# Altium project Modulin v1.0.PrjPcb
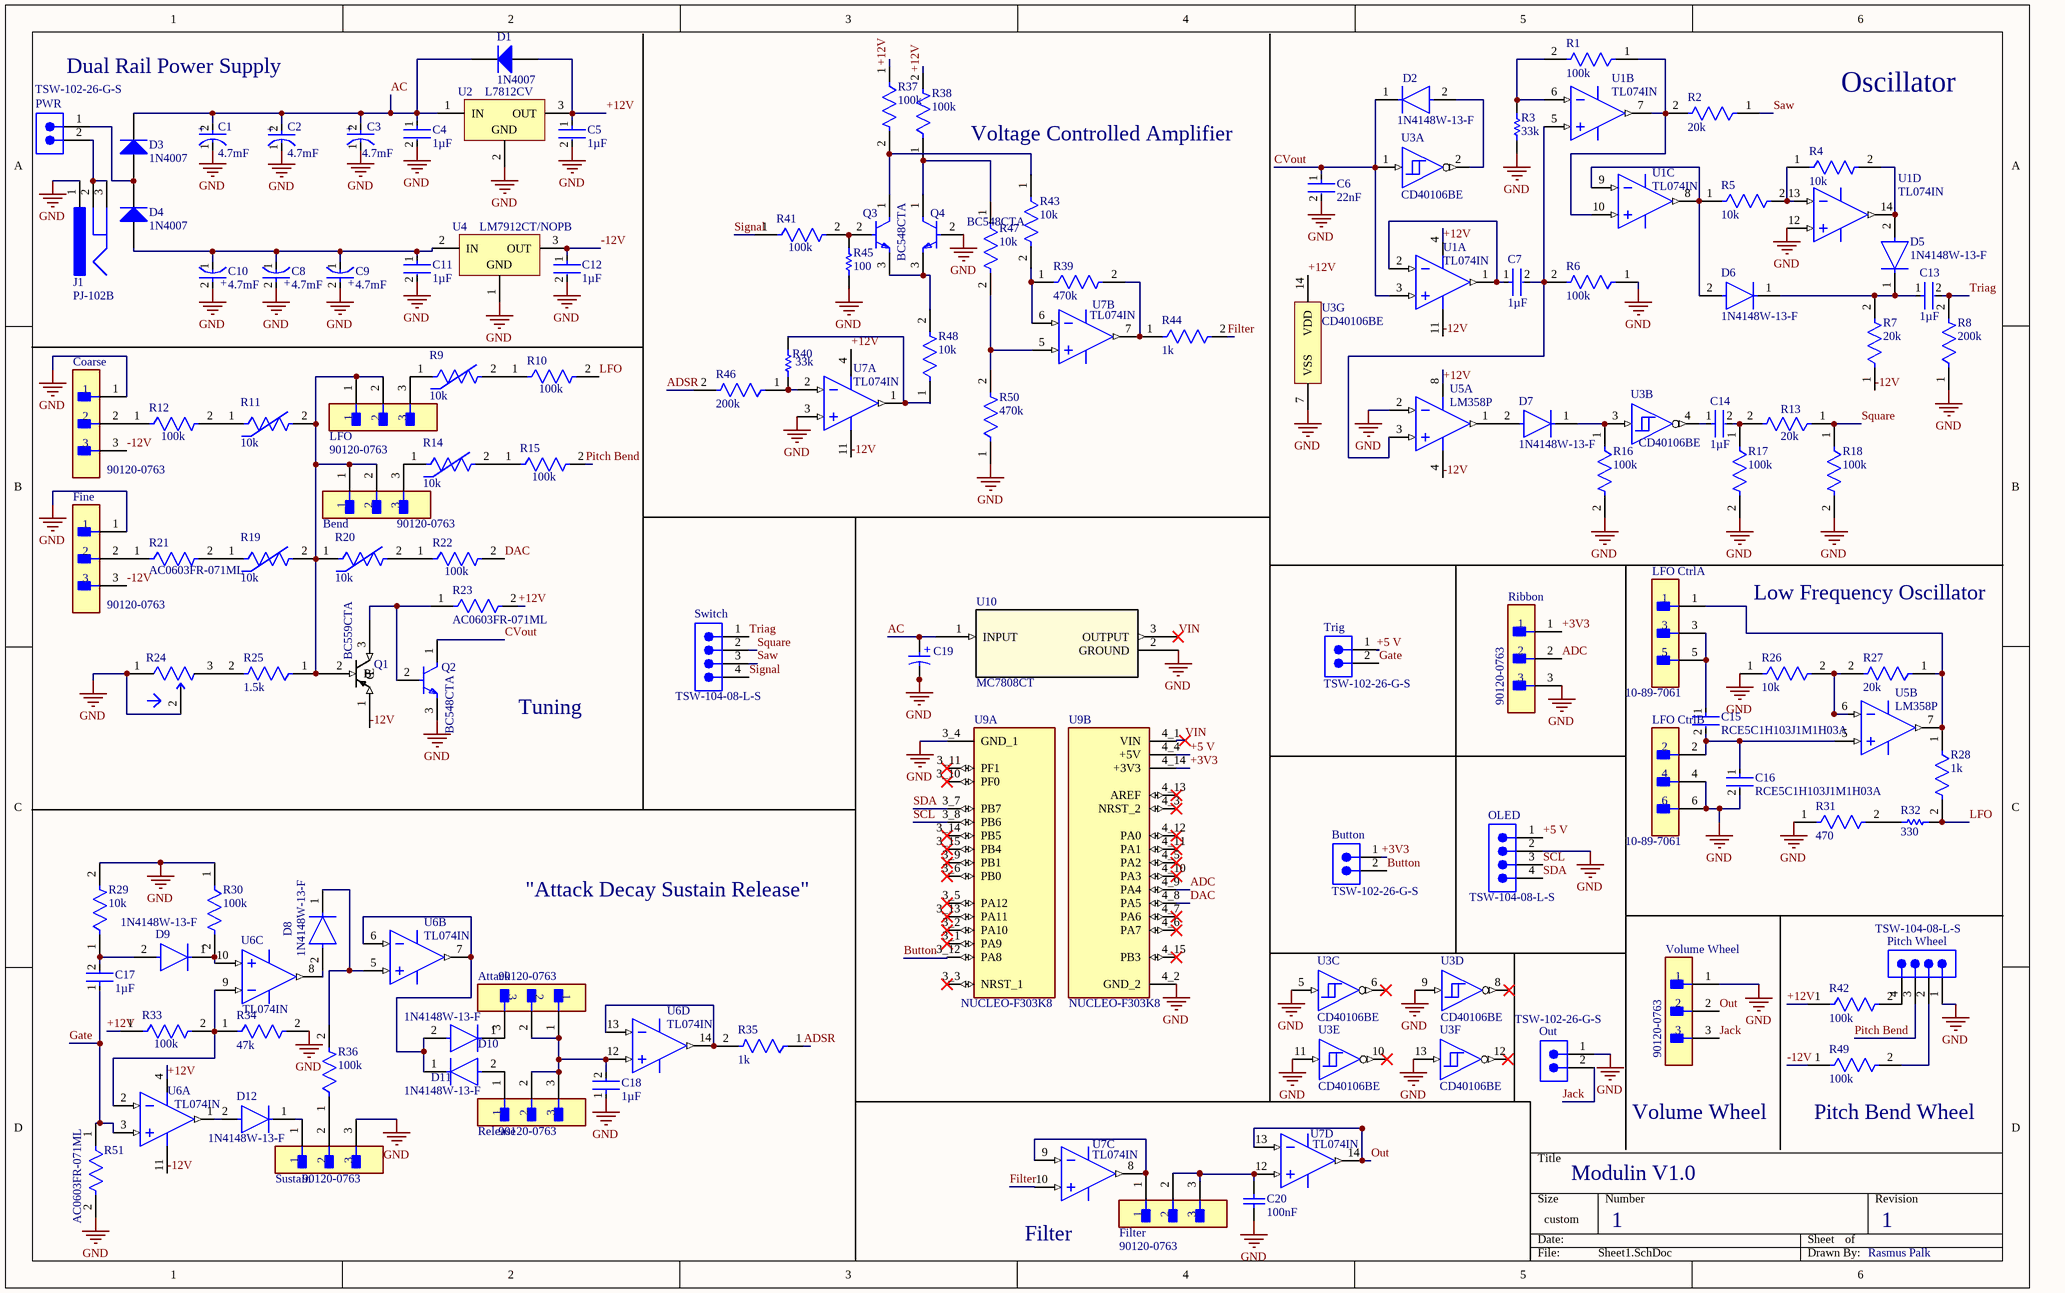
[diagram p0: Sheet1.SchDoc]
1 sheet, 115 parts. Net scope: global (net labels, ports and power ports of the same name join across sheets).
Board file: PCB1.PcbDoc

## Sheet Sheet1.SchDoc
size 381 x 241 mm; SheetNumber: 1; SheetTotal: 1

### Parts
Attack  90120-0763  [FP-90120-0763-MFG]
Bend  90120-0763  [FP-90120-0763-MFG]
Button  TSW-102-26-G-S  [SMTC-TSW-102-26-XX-S]
C1  value 4.7mF  [FP-FKK16-MFG]  (hidden comment: EEV-FK1C472M)
C2  value 4.7mF  [FP-FKK16-MFG]  (hidden comment: EEV-FK1C472M)
C3  value 4.7mF  [FP-FKK16-MFG]  (hidden comment: EEV-FK1C472M)
C4  value 1µF  [FP-0805-L_2_01_0_2-W_1_25-IPC_B]  (hidden comment: 08053C105K4Z2A)
C5  value 1µF  [FP-0805-L_2_01_0_2-W_1_25-IPC_B]  (hidden comment: 08053C105K4Z2A)
C6  value 22nF  [FP-ECQ-E6223KF9-MFG]  (hidden comment: ECQ-E6223KF9)
C7  value 1µF  [FP-0805-L_2_01_0_2-W_1_25-IPC_B]  (hidden comment: 08053C105K4Z2A)
C8  value 4.7mF  [FP-FKK16-MFG]  (hidden comment: EEV-FK1C472M)
C9  value 4.7mF  [FP-FKK16-MFG]  (hidden comment: EEV-FK1C472M)
C10  value 4.7mF  [FP-FKK16-MFG]  (hidden comment: EEV-FK1C472M)
C11  value 1µF  [FP-0805-L_2_01_0_2-W_1_25-IPC_B]  (hidden comment: 08053C105K4Z2A)
C12  value 1µF  [FP-0805-L_2_01_0_2-W_1_25-IPC_B]  (hidden comment: 08053C105K4Z2A)
C13  value 1µF  [FP-0805-L_2_01_0_2-W_1_25-IPC_B]  (hidden comment: 08053C105K4Z2A)
C14  value 1µF  [FP-0805-L_2_01_0_2-W_1_25-IPC_B]  (hidden comment: 08053C105K4Z2A)
C15  RCE5C1H103J1M1H03A  [FP-RCE1K1-2_5-MFG]
C16  RCE5C1H103J1M1H03A  [FP-RCE1K1-2_5-MFG]
C17  value 1µF  [FP-0805-L_2_01_0_2-W_1_25-IPC_B]  (hidden comment: 08053C105K4Z2A)
C18  value 1µF  [FP-0805-L_2_01_0_2-W_1_25-IPC_B]  (hidden comment: 08053C105K4Z2A)
C19  865090640003  [WCAP-ASLU_D4H5.5]  (value not drawn)
C20  value 100nF  [CAPC1608X90X35NL15T15]  (hidden comment: 0603YC104MAT4A)
Coarse  90120-0763  [FP-90120-0763-MFG]
D1  1N4007  [FAIR-DO-41-2]
D2  1N4148W-13-F  [FP-SOD123-IPC_B]
D3  1N4007  [FAIR-DO-41-2]
D4  1N4007  [FAIR-DO-41-2]
D5  1N4148W-13-F  [FP-SOD123-IPC_B]
D6  1N4148W-13-F  [FP-SOD123-IPC_B]
D7  1N4148W-13-F  [FP-SOD123-IPC_B]
D8  1N4148W-13-F  [FP-SOD123-IPC_B]
D9  1N4148W-13-F  [FP-SOD123-IPC_B]
D10  1N4148W-13-F  [FP-SOD123-IPC_B]
D11  1N4148W-13-F  [FP-SOD123-IPC_B]
D12  1N4148W-13-F  [FP-SOD123-IPC_B]
Filter  90120-0763  [FP-90120-0763-MFG]
Fine  90120-0763  [FP-90120-0763-MFG]
J1  PJ-102B  [CUI-PJ-102B_V]
LFO  90120-0763  [FP-90120-0763-MFG]
LFO_Ctrl  10-89-7061  [FP-10-89-7061-MFG]  (parts A,B of 2)
OLED  TSW-104-08-L-S  [SMTC-TSW-104-08-X-S]
Out  TSW-102-26-G-S  [SMTC-TSW-102-26-XX-S]
Pitch_Wheel  TSW-104-08-L-S  [SMTC-TSW-104-08-X-S]
PWR  TSW-102-26-G-S  [SMTC-TSW-102-26-XX-S]
Q1  BC559CTA  [TO-92-3L_5P33X5P2_ONS]
Q2  BC548CTA  [FP-135AR-MFG]
Q3  BC548CTA  [FP-135AR-MFG]
Q4  BC548CTA  [FP-135AR-MFG]
R1  value 100k  [FP-RMCF0603-MFG]  (hidden comment: RMCF0603JT100K)
R2  value 20k  [FP-CRCW0805-e3-IPC_A]  (hidden comment: CRCW080520K0FKEA)
R3  value 33k  [RESC1608X55X30NL20T20]  (hidden comment: ERA-3AEB333V)
R4  value 10k  [FP-MCT0603-MFG]  (hidden comment: MCT06030E1002BP500)
R5  value 10k  [FP-MCT0603-MFG]  (hidden comment: MCT06030E1002BP500)
R6  value 100k  [FP-RMCF0603-MFG]  (hidden comment: RMCF0603JT100K)
R7  value 20k  [FP-CRCW0805-e3-IPC_A]  (hidden comment: CRCW080520K0FKEA)
R8  value 200k  [FP-CRCW0603-e3-IPC_C]  (hidden comment: CRCW0603200KFKEA)
R9  value 10k  [FP-NTSA0_E1-MFG]  (hidden comment: NTSA0XV103EE1B0)
R10  value 100k  [FP-RMCF0603-MFG]  (hidden comment: RMCF0603JT100K)
R11  value 10k  [FP-NTSA0_E1-MFG]  (hidden comment: NTSA0XV103EE1B0)
R12  value 100k  [FP-RMCF0603-MFG]  (hidden comment: RMCF0603JT100K)
R13  value 20k  [FP-CRCW0805-e3-IPC_A]  (hidden comment: CRCW080520K0FKEA)
R14  value 10k  [FP-NTSA0_E1-MFG]  (hidden comment: NTSA0XV103EE1B0)
R15  value 100k  [FP-RMCF0603-MFG]  (hidden comment: RMCF0603JT100K)
R16  value 100k  [FP-RMCF0603-MFG]  (hidden comment: RMCF0603JT100K)
R17  value 100k  [FP-RMCF0603-MFG]  (hidden comment: RMCF0603JT100K)
R18  value 100k  [FP-RMCF0603-MFG]  (hidden comment: RMCF0603JT100K)
R19  value 10k  [FP-NTSA0_E1-MFG]  (hidden comment: NTSA0XV103EE1B0)
R20  value 10k  [FP-NTSA0_E1-MFG]  (hidden comment: NTSA0XV103EE1B0)
R21  AC0603FR-071ML  [FP-AC0603-IPC_C]
R22  value 100k  [FP-RMCF0603-MFG]  (hidden comment: RMCF0603JT100K)
R23  AC0603FR-071ML  [FP-AC0603-IPC_C]
R24  PV36W102C01B00  [FP-PV36W-MFG]  (value not drawn)
R25  value 1.5k  [FP-CRCW0603-e3-IPC_C]  (hidden comment: CRCW06031K50FKEA)
R26  value 10k  [FP-MCT0603-MFG]  (hidden comment: MCT06030E1002BP500)
R27  value 20k  [FP-CRCW0805-e3-IPC_A]  (hidden comment: CRCW080520K0FKEA)
R28  value 1k  [FP-RCA0603-e3-IPC_B]  (hidden comment: RCA06031K00FKEA)
R29  value 10k  [FP-MCT0603-MFG]  (hidden comment: MCT06030E1002BP500)
R30  value 100k  [FP-RMCF0603-MFG]  (hidden comment: RMCF0603JT100K)
R31  value 470  [FP-CPF0603-MFG]  (hidden comment: CPF0603B470RE)
R32  value 330  [RESC1608X55X30LL20T10]  (hidden comment: SG73P1JTTD3300F)
R33  value 100k  [FP-RMCF0603-MFG]  (hidden comment: RMCF0603JT100K)
R34  value 47k  [FP-MCT0603-MFG]  (hidden comment: MCT0603MD4702DP500)
R35  value 1k  [FP-RCA0603-e3-IPC_B]  (hidden comment: RCA06031K00FKEA)
R36  value 100k  [FP-RMCF0603-MFG]  (hidden comment: RMCF0603JT100K)
R37  value 100k  [FP-RMCF0603-MFG]  (hidden comment: RMCF0603JT100K)
R38  value 100k  [FP-RMCF0603-MFG]  (hidden comment: RMCF0603JT100K)
R39  value 470k  [FP-CRCW0603-e3-MFG]  (hidden comment: CRCW0603470KFKEA)
R40  value 33k  [RESC1608X55X30NL20T20]  (hidden comment: ERA-3AEB333V)
R41  value 100k  [FP-RMCF0603-MFG]  (hidden comment: RMCF0603JT100K)
R42  value 100k  [FP-RMCF0603-MFG]  (hidden comment: RMCF0603JT100K)
R43  value 10k  [FP-MCT0603-MFG]  (hidden comment: MCT06030E1002BP500)
R44  value 1k  [FP-RCA0603-e3-IPC_B]  (hidden comment: RCA06031K00FKEA)
R45  value 100  [RESC1608X50X30LL20T20]  (hidden comment: RG1608V-101-P-T1)
R46  value 200k  [FP-CRCW0603-e3-IPC_C]  (hidden comment: CRCW0603200KFKEA)
R47  value 10k  [FP-MCT0603-MFG]  (hidden comment: MCT06030E1002BP500)
R48  value 10k  [FP-MCT0603-MFG]  (hidden comment: MCT06030E1002BP500)
R49  value 100k  [FP-RMCF0603-MFG]  (hidden comment: RMCF0603JT100K)
R50  value 470k  [FP-CRCW0603-e3-MFG]  (hidden comment: CRCW0603470KFKEA)
R51  AC0603FR-071ML  [FP-AC0603-IPC_C]
Release  90120-0763  [FP-90120-0763-MFG]
Ribbon  90120-0763  [FP-90120-0763-MFG]
Sustain  90120-0763  [FP-90120-0763-MFG]
Switch  TSW-104-08-L-S  [SMTC-TSW-104-08-X-S]
Trig  TSW-102-26-G-S  [SMTC-TSW-102-26-XX-S]
U1  TL074IN  [N0014A]  (parts A,B,C,D of 4)
U2  L7812CV  [TO220]
U3  CD40106BE  [N0014A]  (parts A,B,C,D,E,F,G of 7)
U4  LM7912CT/NOPB  [NDE0003A]
U5  LM358P  [P0008A]  (parts A,B of 2)
U6  TL074IN  [N0014A]  (parts A,B,C,D of 4)
U7  TL074IN  [N0014A]  (parts A,B,C,D of 4)
U9  NUCLEO-F303K8  [MODULE_NUCLEO-F303K8]  (parts A,B of 2)
U10  MC7808CT  [TO220-3_ONS]
Volume_Wheel  90120-0763  [FP-90120-0763-MFG]

### Nets
GND: C1.1(C) C2.1(C) C3.1(C) C4.2 C5.2 C6.2 C8.2(A) C9.2(A) C10.2(A) C11.2 C12.2 C16.2 C18.1 C19.2(N) C20.1 Coarse.1 Fine.1 J1.1 LFO_Ctrl.4 LFO_Ctrl.6 OLED.2 Out.1 Pitch_Wheel.1 Q2.3(E) Q4.2(B) R3.1 R6.1 R8.1 R16.2 R17.2 R18.2 R24.1 R24.2(Wiper) R26.1 R29.2 R30.1 R31.1 R34.2 R45.1 R50.1 R51.2 Ribbon.3 Sustain.3 U1.12(IN4+) U2.2(GND) U3.5(C) U3.7(VSS) U3.9(D) U3.11(E) U3.13(F) U4.1(GND) U5.2(1IN-) U7.3(IN1+) U9.3_4(GND_1) U9.4_2(GND_2) U10.2(GROUND) Volume_Wheel.1
+3V3: Button.1 Ribbon.1 U9.4_14(+3V3)
+5 V: OLED.1 Trig.1 U9.4_4(+5V)
+12V: C5.1 D1.2(A) R23.2 R33.1 R37.1 R38.2 R42.1 U1.4(VCC+) U2.3(OUT) U3.14(VDD) U5.8(VCC) U6.4(VCC+) U7.4(VCC+)
-12V: C12.1 Coarse.3 Fine.3 Q1.1(C) R7.1 R49.1 U1.11(VCC-) U4.3(OUT) U5.4(GND) U6.11(VCC-) U7.11(VCC-)
AC: C1.2(A) C2.2(A) C3.2(A) C4.1 C19.1(P) D1.1(K) D3.1(K) U2.1(IN) U10.1(INPUT)
ADC: Ribbon.2 U9.4_9(PA4)
ADSR: R35.1 R46.2
Button: Button.2 U9.3_12(PA8)
CVout: C6.1 D2.1(C) Q2.1(C) U1.3(IN1+) U3.1(A)
DAC: R22.2 U9.4_8(PA5)
Filter: R44.2 U7.10(IN3+)
Gate: C17.1 R51.1 Trig.2 U6.3(IN1+)
Jack: Out.2 Volume_Wheel.3
LFO: R10.2 R28.2 R32.1
Out: U7.13(IN4-) U7.14(OUT4) Volume_Wheel.2
Pitch Bend: Pitch_Wheel.3 R15.2
Saw: R2.1 Switch.3
SCL: OLED.3 U9.3_8(PB6)
SDA: OLED.4 U9.3_7(PB7)
Signal: R41.1 Switch.4
Square: R13.1 R18.1 Switch.2
Triag: C13.2 R8.2 Switch.1
VIN: U9.4_1(VIN) U10.3(OUTPUT)
NetAttack_1: Attack.1 Attack.2 C18.2 Release.2 Release.3 U6.12(IN4+)
NetAttack_3: Attack.3 D10.1(C)
NetBend_1: Bend.1 Bend.2 LFO.1 LFO.2 Q1.2(B) R11.2 R19.2 R20.1 R25.1
NetBend_3: Bend.3 R14.1
NetC7_1: C7.1 U1.1(OUT1) U1.2(IN1-)
NetC7_2: C7.2 R6.2 U1.5(IN2+) U5.3(1IN+)
NetC8_1: C8.1(C) C9.1(C) C10.1(C) C11.1 D4.2(A) U4.2(IN)
NetC13_1: C13.1 D5.1(C) D6.1(C) R7.2
NetC14_1: C14.1 U3.4(H=~{B})
NetC14_2: C14.2 R13.2 R17.1
NetC15_1: C15.1 LFO_Ctrl.3 LFO_Ctrl.5
NetC15_2: C15.2 C16.1 LFO_Ctrl.2 U5.5(2IN+)
NetC17_2: C17.2 D9.2(A) R29.1
NetC20_2: C20.2 Filter.2 Filter.3 U7.12(IN4+)
NetCoarse_2: Coarse.2 R12.1
NetD2_2: D2.2(A) U3.2(G=~{A})
NetD3_2: D3.2(A) D4.1(K) PWR.1
NetD5_2: D5.2(A) R4.2 U1.14(OUT4)
NetD6_2: D6.2(A) R5.1 U1.8(OUT3) U1.9(IN3-)
NetD7_1: D7.1(C) R16.1 U3.3(B)
NetD7_2: D7.2(A) U5.1(1OUT)
NetD8_1: D8.1(C) R36.2 U6.5(IN2+)
NetD8_2: D8.2(A) U6.8(OUT3)
NetD9_1: D9.1(C) R30.2 U6.10(IN3+)
NetD10_2: D10.2(A) D11.1(C) U6.6(IN2-) U6.7(OUT2)
NetD11_2: D11.2(A) Release.1
NetD12_1: D12.1(C) Sustain.1
NetD12_2: D12.2(A) U6.1(OUT1)
NetFilter_1: Filter.1 U7.8(OUT3) U7.9(IN3-)
NetFine_2: Fine.2 R21.1
NetJ1_2: J1.2 J1.3 PWR.2
NetLFO_3: LFO.3 R9.1
NetLFO_Ctrl_1: LFO_Ctrl.1 R27.1 R28.1 U5.7(2OUT)
NetPitch_Wheel_2: Pitch_Wheel.2 R49.2
NetPitch_Wheel_4: Pitch_Wheel.4 R42.2
NetQ1_3: Q1.3(E) Q2.2(B) R23.1
NetQ3_1: Q3.1(C) R37.2 R43.1
NetQ3_2: Q3.2(B) R41.2 R45.2
NetQ3_3: Q3.3(E) Q4.3(E) R48.2
NetQ4_1: Q4.1(C) R38.1 R47.1
NetR1_1: R1.1 R2.2 U1.7(OUT2) U1.10(IN3+)
NetR1_2: R1.2 R3.2 U1.6(IN2-)
NetR4_1: R4.1 R5.2 U1.13(IN4-)
NetR9_2: R9.2 R10.1
NetR11_1: R11.1 R12.2
NetR14_2: R14.2 R15.1
NetR19_1: R19.1 R21.2
NetR20_2: R20.2 R22.1
NetR24_3: R24.3 R25.2
NetR26_2: R26.2 R27.2 U5.6(2IN-)
NetR31_2: R31.2 R32.2
NetR33_2: R33.2 R34.1 U6.2(IN1-) U6.9(IN3-)
NetR35_2: R35.2 U6.13(IN4-) U6.14(OUT4)
NetR36_1: R36.1 Sustain.2
NetR39_1: R39.1 R43.2 U7.6(IN2-)
NetR39_2: R39.2 R44.1 U7.7(OUT2)
NetR40_1: R40.1 R48.1 U7.1(OUT1)
NetR40_2: R40.2 R46.1 U7.2(IN1-)
NetR47_2: R47.2 R50.2 U7.5(IN2+)

Not connected (* = marked no-connect by the designer): U3 6(I=~{C})* 8(J=~{D})* 10(K=~{E})* 12(L=~{F})*; U9 3_1(PA9)* 3_2(PA10)* 3_3(NRST_1)* 3_5(PA12)* 3_6(PB0)* 3_9(PB1)* 3_10(PF0)* 3_11(PF1)* 3_13(PA11)* 3_14(PB5)* 3_15(PB4)* 4_3(NRST_2)* 4_5(PA2)* 4_6(PA7)* 4_7(PA6)* 4_10(PA3)* 4_11(PA1)* 4_12(PA0)* 4_13(AREF)* 4_15(PB3)*

### Notes on the sheet
- Dual Rail Power Supply
- Oscillator
- Voltage Controlled Amplifier
- Low Frequency Oscillator
- Tuning
- "Attack Decay Sustain Release"
- Modulin V1.0
- Volume Wheel
- (near R49) Pitch Bend Wheel
- (near U7) Filter
- 1
- Rasmus Palk
- (in symbol CMP-001-00088-1) +
- (in symbol CMP-001-00089-1) +

### Library data of the parts
Attack Bend Coarse Filter Fine LFO Release Ribbon Sustain Volume_Wheel = CMP-04776-000084-1: CONN HEADER VERT 3POS 2.54MM; Manufacturer: Molex; Voltage Rating: 350V; Number Of Contacts: 3; Conn Orientation: Vertical; Current Rating: 3A; Conn Gender: Male; Package: 90120-0763; ComponentLink2Description: Datasheet; Height: 5.8mm; Manufacturer Part Number: 90120-0763; Temperature Range High: +125°C; RoHS: TRUE; ComponentLink2URL: https://www.molex.com/webdocs/datasheets/pdf/en-us/0901200763_PCB_HEADERS.pdf; Device Class L2: Headers and Wire Housings; Temperature: -55°C to +125°C; Device Class L1: Connectors; Pitch: 2.54mm; Footprint Url: https://www.molex.com/pdm_docs/sd/901200763_sd.pdf; Device Class L3: unset; Temperature Range Low: -55°C; Number Of Rows: 1; Category: Conn; Lead Free: Yes; Mouser Description: Board-To-Board Connector, C-Grid III 90120 Series, Through Hole, Header, 3, 2.54 mm; Octopart: https://octopart.com/90120-0763-molex-655433; Contact Material: Gold,Nickel; Automotive: No; Digikey Description: CONN HEADER VERT 3POS 2.54MM
Button Out PWR Trig = CMP-002-00078-1: Board Connector, 2 Contact(s), 1 Row(s), Male, Straight, 0.1 inch Pitch, Solder Terminal, Black Insulator, Receptacle; Mounting Technology: Board; Connector Type: BOARD CONNECTOR; RoHS Compliant: Yes
C1-C3 C8-C10 = CMP-001-00088-1: Aluminum Electrolytic Capacitor, Polarized, Aluminum (wet), 16V, 20% +Tol, 20% -Tol, 4700uF, Surface Mount, 7575; Ripple Current: 1.545A; Capacitor Type: Aluminium; Pins: 2; RoHS Compliant: Yes; Mounting Technology: Surface Mount; Min Operating Temperature: -55°C; Max Operating Temperature: 105°C; Case/Package: 7575
C4 C5 C7 C11-C14 C17 C18 = CMP-001-00083-1: Ceramic Capacitor, Multilayer, Ceramic, 25V, 10% +Tol, 10% -Tol, X7R, 15% TC, 1uF, Surface Mount, 0805; Max Operating Temperature: 125°C; Min Operating Temperature: -55°C; Pins: 2; Mounting Technology: Surface Mount; RoHS Compliant: Yes; Capacitor Type: Ceramic; Case/Package: 0805
C6 = CMP-001-00085-1: Film Capacitor, Polyester, 630V, 10% +Tol, 10% -Tol, 0.022uF, Through Hole Mount, 4719; Pins: 2; Min Operating Temperature: -40°C; Max Operating Temperature: 85°C; Capacitor Type: FILM; Case/Package: 4719; RoHS Compliant: Yes; Mounting Technology: Through Hole
C15 C16 = CMP-06035-061841-1: Cap Ceramic Monolithic 10nF 50V 5% Thru-Hole Bulk; Lead/Base Style: Formed Leads; Lead Diameter: 0.5mm; Dielectric: C0G; Height - Seated (Max): 0.138inch; Termination: Radial; Ratings: AEC-Q200; Width: 0.098inch; RoHS Compliant: Yes; Package Quantity: 2000; Voltage: 50V; Packaging: Tape and Reel; Voltage Rating (DC): 50V; Depth: 2.5mm; Tolerance: 5%; Voltage Rating: 50V; Length: 4mm; Capacitance: 10nF; Height: 3.5mm; Min Operating Temperature: -55°C; Max Operating Temperature: 125°C; Case/Package: Radial; Mount: Through Hole; Resistor Type: Ceramic; Lead Pitch: 0.197inch
C19 = CMP-001-00089-1: Aluminum Electrolytic Capacitor, Aluminum (wet); Capacitor Type: Aluminium; RoHS Compliant: Yes; Pins: 2
C20 = CMP-001-00087-1: Ceramic Capacitor, Multilayer, Ceramic, 16V, 20% +Tol, 20% -Tol, X7R, 15% TC, 0.1uF, Surface Mount, 0603; Min Operating Temperature: -55°C; Case/Package: 0603; Mounting Technology: Surface Mount; Max Operating Temperature: 125°C; Capacitor Type: Ceramic; RoHS Compliant: Yes; Pins: 2
D1 D3 D4 = CMP-004-00007-2: General Purpose Rectifier, 1.1 V, 1.0 A, -55 to 175 degC, 2-Pin DO-41, RoHS, Tape and Reel; Manufacturer: Fairchild; Peak Reverse Current: 5uA; Max Surge Current: 30A; Elements: 1; Forward Voltage: 1.1V; Package Version: Rev. 2, 09/2008; Forward Current: 1A; Package Quantity: 5000; Packaging: TapeandReel; Package URL: http://www.fairchildsemi.com/dwg/DO/DO41A.pdf; Manufacturer URL: https://www.fairchildsemi.com/; Package Reference: DO-41-2; Pins: 2; Min Operating Temperature: -55°C; Datasheet Version: Rev. 1.1.0, 11/2014; Max Operating Temperature: 175°C; RoHS Compliant: True; Case/Package: DO-41-2; Mounting Technology: TH; Package Description: 2-Pin Axial Lead, Dia 2.375 mm, Body Length 4.63 mm; Datasheet URL: https://www.fairchildsemi.com/datasheets/1N/1N4007.pdf
D2 D5-D12 = CMP-004-00031-1: Rectifier Diode, 1 Phase, 1 Element, 0.15A, 100V V(RRM), Silicon; Forward Voltage: 715mV; Pins: 2; Min Operating Temperature: -65°C; Max Operating Temperature: 150°C; RoHS Compliant: Yes
J1 = CMP-002-00074-1: 24V, 2.5A, 2.5mm Dia
LFO_Ctrl = CMP-002-00076-1: Board Connector, 6 Contact(s), 2 Row(s), Male, Straight, 0.1 inch Pitch, Solder Terminal, Locking, Black Insulator, Receptacle; Min Operating Temperature: -40°C; Max Operating Temperature: 105°C; Connector Type: BOARD CONNECTOR; RoHS Compliant: Yes; Mounting Technology: Board
OLED Pitch_Wheel Switch = CMP-002-00077-1: Board Connector, 4 Contact(s), 1 Row(s), Male, Straight, Solder Terminal; Connector Type: BOARD CONNECTOR; Mounting Technology: Board; RoHS Compliant: Yes
Q1 = CMP-013-00034-2: Small Signal Bipolar Transistor, 0.1A I(C), 30V V(BR)CEO, 1-Element, PNP, Silicon, TO-92; Frequency: 150MHz; RoHS Compliant: Yes; Pins: 3; Max Operating Temperature: 150°C
Q2-Q4 = CMP-013-00035-1: Small Signal Bipolar Transistor, 0.1A I(C), 30V V(BR)CEO, 1-Element, NPN, Silicon, TO-92; Frequency: 300MHz; Max Operating Temperature: 150°C; RoHS Compliant: Yes; Pins: 3
R1 R6 R10 R12 R15-R18 R22 R30 R33 R36-R38 R41 R42 R49 = CMP-009-00181-1: Fixed Resistor, Metal Glaze/thick Film, 0.1W, 100000ohm, 75V, 5% +/-Tol, 200ppm/Cel, Surface Mount, 0603; Power: 100mW; Tolerance: 5%; RoHS Compliant: Yes; Mounting Technology: Surface Mount; Pins: 2; Min Operating Temperature: -55°C; Max Operating Temperature: 155°C; Case/Package: 0603
R2 R7 R13 R27 = CMP-009-00179-1: Fixed Resistor, Metal Glaze/thick Film, 0.125W, 20000ohm, 150V, 1% +/-Tol, 100ppm/Cel, Surface Mount, 0805; Power: 125mW; Pins: 2; RoHS Compliant: Yes; Min Operating Temperature: -55°C; Tolerance: 1%; Max Operating Temperature: 155°C; Mounting Technology: Surface Mount; Case/Package: 0805
R3 R40 = CMP-009-00188-1: Fixed Resistor, Thin Film, 0.1W, 33000ohm, 75V, 0.1% +/-Tol, 25ppm/Cel, Surface Mount, 0603; Power: 100mW; Tolerance: 0.1%; Max Operating Temperature: 155°C; RoHS Compliant: Yes; Min Operating Temperature: -55°C; Case/Package: 0603; Pins: 2; Mounting Technology: Surface Mount
R4 R5 R26 R29 R43 R47 R48 = CMP-009-00182-1: Fixed Resistor, Thin Film, 0.1W, 10000ohm, 75V, 0.1% +/-Tol, 15ppm/Cel, Surface Mount, 0603; Power: 100mW; RoHS Compliant: Yes; Min Operating Temperature: -55°C; Case/Package: 0603; Tolerance: 0.1%; Pins: 2; Max Operating Temperature: 125°C; Mounting Technology: Surface Mount
R8 R46 = CMP-009-00180-1: Fixed Resistor, Metal Glaze/thick Film, 0.1W, 200000ohm, 75V, 1% +/-Tol, 100ppm/Cel, Surface Mount, 0603; Power: 100mW; Max Operating Temperature: 155°C; Min Operating Temperature: -55°C; Case/Package: 0603; Tolerance: 1%; Pins: 2; Mounting Technology: Surface Mount; RoHS Compliant: Yes
R9 R11 R14 R19 R20 = CMP-009-00190-1: NTC Thermistor, 10000ohm, Through Hole Mount; Tolerance: 3%; Power: 15mW; Pins: 2; Min Operating Temperature: -40°C; RoHS Compliant: Yes; Max Operating Temperature: 125°C; Mounting Technology: Through Hole
R21 R23 R51 = CMP-2000-04829-2: RES 1MΩ 1.00% 0.1W 0603; Voltage Rating: 50V; Tolerance: 1%; Max Power Dissipation: 100mW; Resistance: 1MR; Temperature Coefficient: 100ppm/°C; Length: 0.063inch; Packaging: Tape and Reel; Number of Terminations: 2; Width: 0.031inch; Case/Package: 0603; Max Operating Temperature: 155°C; Height: 0.022inch; Termination: SMD/SMT; Series: AC; Min Operating Temperature: -55°C; Case Code (Metric): 1608; Resistor Type: Thick Film; Power Rating: 100mW; Case Code (Imperial): 0603; RoHS Compliant: Yes; Features: Moisture Resistant; Lead Free: Lead Free; Package Quantity: 1; Ratings: AEC-Q200
R24 = CMP-009-00177-1: Trimmer, Cermet, 0.5W, 1000ohm, 10% +/-Tol, 100ppm/Cel, 25 Turn(s); RoHS Compliant: Yes
R25 = CMP-009-00178-1: Fixed Resistor, Metal Glaze/thick Film, 0.1W, 1500ohm, 75V, 1% +/-Tol, 100ppm/Cel, Surface Mount, 0603; Power: 100mW; Min Operating Temperature: -55°C; RoHS Compliant: Yes; Mounting Technology: Surface Mount; Max Operating Temperature: 155°C; Case/Package: 0603; Tolerance: 1%; Pins: 2
R28 R35 R44 = CMP-009-00183-1: Fixed Resistor, Metal Glaze/thick Film, 0.1W, 1000ohm, 75V, 1% +/-Tol, 100ppm/Cel, Surface Mount, 0603; Power: 100mW; Case/Package: 0603; Tolerance: 1%; Pins: 2; Mounting Technology: Surface Mount; RoHS Compliant: Yes; Min Operating Temperature: -55°C; Max Operating Temperature: 155°C
R31 = CMP-009-00185-1: Fixed Resistor, Thin Film, 0.063W, 470ohm, 50V, 0.1% +/-Tol, 25ppm/Cel, Surface Mount, 0603; Power: 63mW; Pins: 2; RoHS Compliant: Yes; Mounting Technology: Surface Mount; Max Operating Temperature: 155°C; Tolerance: 0.1%; Min Operating Temperature: -55°C; Case/Package: 0603
R32 = CMP-009-00186-1: Fixed Resistor, Metal Glaze/thick Film, 0.33W, 330ohm, 150V, 1% +/-Tol, 100ppm/Cel, Surface Mount, 0603; Power: 200mW; Min Operating Temperature: -55°C; Tolerance: 1%; Mounting Technology: Surface Mount; Max Operating Temperature: 155°C; Case/Package: 0603; Pins: 2; RoHS Compliant: Yes
R34 = CMP-009-00187-1: Fixed Resistor, Thin Film, 0.1W, 47000ohm, 75V, 0.5% +/-Tol, 25ppm/Cel, Surface Mount, 0603; Power: 100mW; Min Operating Temperature: -55°C; Tolerance: 0.5%; Mounting Technology: Surface Mount; Case/Package: 0603; Pins: 2; Max Operating Temperature: 125°C; RoHS Compliant: Yes
R39 R50 = CMP-009-00189-1: Fixed Resistor, Metal Glaze/thick Film, 0.1W, 470000ohm, 75V, 1% +/-Tol, 100ppm/Cel, Surface Mount, 0603; Power: 100mW; RoHS Compliant: Yes; Min Operating Temperature: -55°C; Pins: 2; Mounting Technology: Surface Mount; Case/Package: 0603; Max Operating Temperature: 155°C; Tolerance: 1%
R45 = CMP-009-00184-1: Fixed Resistor, Metal Film, 0.1W, 100ohm, 75V, 0.02% +/-Tol, 5ppm/Cel, Surface Mount, 0603; Power: 100mW; RoHS Compliant: Yes; Case/Package: 0603; Pins: 2; Min Operating Temperature: -55°C; Max Operating Temperature: 155°C; Tolerance: 0.02%; Mounting Technology: Surface Mount
U1 U6 U7 = CMP-014-00004-1: Operational Amplifier, 4 Func, 6000uV Offset-Max, BIPolar, PDIP14; Channels: 4; Nominal Supply Voltage: 15V; Min Operating Temperature: -40°C; RoHS Compliant: Yes; Case/Package: DIP; Max Operating Temperature: 85°C; Pins: 14
U2 = CMP-019-00049-1: Fixed Positive Standard Regulator, 12VBIPolar, PSFM3; Max Supply Voltage: 30V; RoHS Compliant: Yes; Pins: 3
U3 = CMP-016-00010-1: Inverter, 4000/14000/40000 Series, 6-Func, 1-Input, CMOS, PDIP14; Max Supply Voltage: 18V; Nominal Supply Voltage: 5V; Min Supply Voltage: 3V; Logic Type: INVERTER; Case/Package: DIP; Min Operating Temperature: -55°C; Max Operating Temperature: 125°C; RoHS Compliant: Yes; Pins: 14
U4 = CMP-019-00050-1: Fixed Negative Standard Regulator, 12V, BIPolar, PSFM3; Max Supply Voltage: 30V; Pins: 3; RoHS Compliant: Yes
U5 = CMP-014-00002-1: Operational Amplifier, 2 Func, 9000uV Offset-Max, BIPolar, PDIP8; Channels: 2; Nominal Supply Voltage: 5V; Max Operating Temperature: 70°C; Min Operating Temperature: 0°C; Pins: 8; RoHS Compliant: Yes; Case/Package: DIP
U9 = NUCLEO-F303K8: STM32F303K8, mbed-Enabled Development Nucleo-32 STM32F3 ARMÂ® CortexÂ®-M4 MCU 32-Bit Embedded Evaluation Board; MF: STMicroelectronics; Value: *; Package: None; Check_prices: https://www.snapeda.com/parts/NUCLEO-F303K8/STMicroelectronics/view-part/?ref=eda; Price: None; MP: NUCLEO-F303K8; Availability: In Stock; SnapEDA_Link: https://www.snapeda.com/parts/NUCLEO-F303K8/STMicroelectronics/view-part/?ref=snap; Purchase-URL: https://pricing.snapeda.com/search/part/NUCLEO-F303K8/?ref=eda
U10 = MC7808CT: No Description Available; Mfr_Name: onsemi / Fairchild Semiconductor; RefDes: RefDes; Type: Type